# EAGLE design Logic (EAGLE 9.2.2)

## Sheet 1 of 2
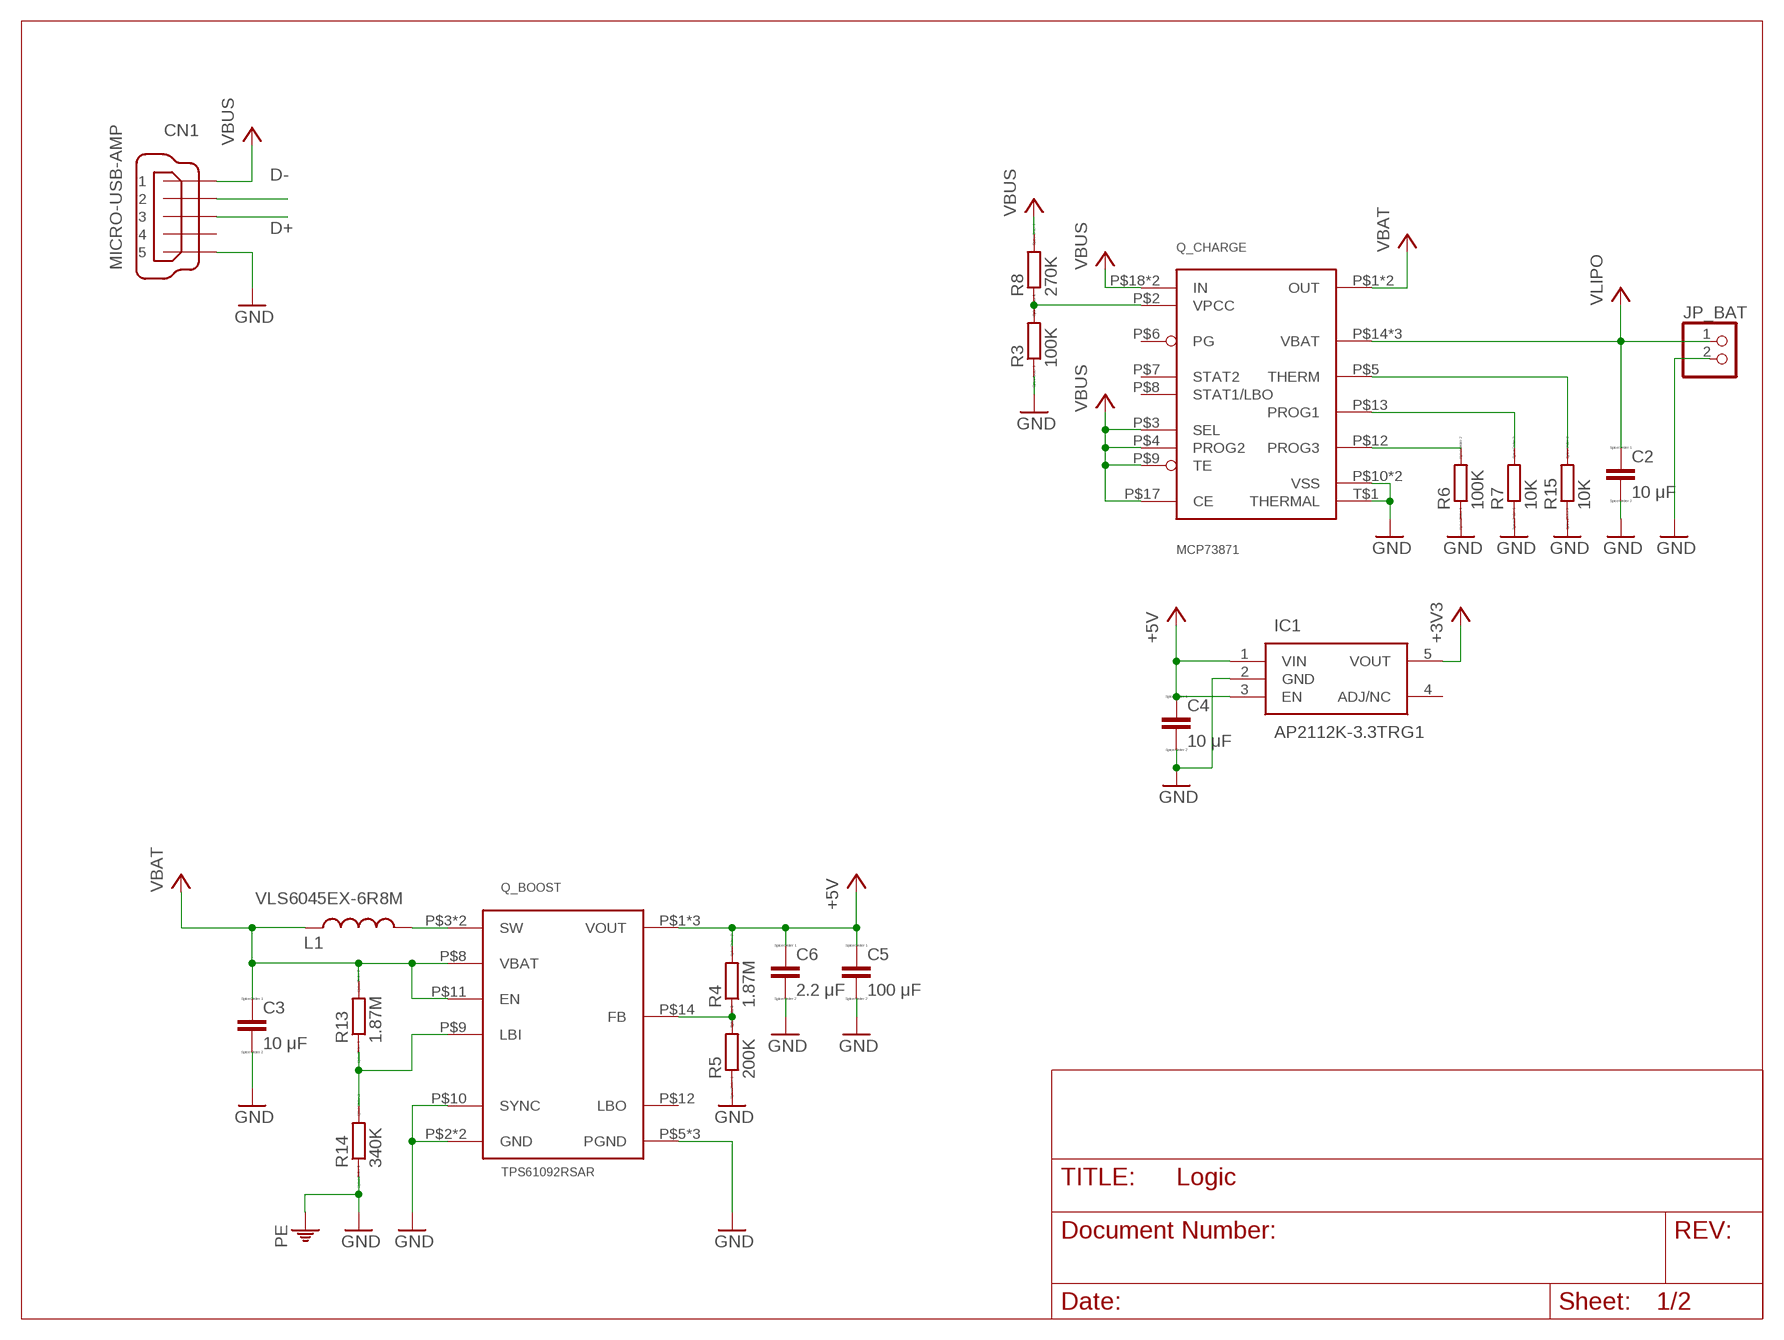
[diagram p0: schematic, sheet 1]

### Parts
C2  10 μF  CC0603  [C0603]
C3  10 μF  CC0603  [C0603]
C4  10 μF  CC0603  [C0603]
C5  100 μF  CC1206  [C1206]
C6  2.2 μF  CC0603  [C0603]
CN1  MICRO-USB-AMP  [10118193-0001LF]
IC1  AP2112K-3.3TRG1  [SOT95P282X130-5N]
JP_BAT  PINHD-1X2  [1X02]
L1  VLS6045EX-6R8M  [VLS6045EX-6R8M]
Q_BOOST  TPS61092RSAR  [TPS61092RSAR]
Q_CHARGE  MCP73871  [MCP73871]
R3  100K  RR0603  [R0603]
R4  1.87M  RR0603  [R0603]
R5  200K  RR0603  [R0603]
R6  100K  RR0603  [R0603]
R7  10K  RR0603  [R0603]
R8  270K  RR0603  [R0603]
R13  1.87M  RR0603  [R0603]
R14  340K  RR0603  [R0603]
R15  10K  RR0603  [R0603]

### Nets
+3V3: IC1.5(VOUT) ; also sheet 2
+5V: C4.1 C5.1 C6.1 IC1.1(VIN) IC1.3(EN) Q_BOOST.P$1(VOUT) Q_BOOST.P$15(VOUT) Q_BOOST.P$16(VOUT) R4.2 ; also sheet 2
D+: CN1.3 ; also sheet 2
D-: CN1.2 ; also sheet 2
FB: Q_BOOST.P$14(FB) R4.1 R5.2
GND: C2.2 C3.2 C4.2 C5.2 C6.2 CN1.5 CN1.G1 CN1.G2 IC1.2(GND) JP_BAT.2 Q_BOOST.P$2(GND) Q_BOOST.P$5(PGND) Q_BOOST.P$6(PGND) Q_BOOST.P$7(PGND) Q_BOOST.P$10(SYNC) Q_BOOST.P$13(GND) Q_CHARGE.P$10(VSS) Q_CHARGE.P$11(VSS) Q_CHARGE.T$1(THERMAL) R3.1 R5.1 R6.1 R7.1 R14.1 R15.1 ; supply symbol labelled PE ; also sheet 2
N$5: Q_BOOST.P$9(LBI) R13.1 R14.2
N$6: Q_CHARGE.P$12(PROG3) R6.2
N$7: Q_CHARGE.P$13(PROG1) R7.2
N$8: Q_CHARGE.P$5(THERM) R15.2
SW: L1.P$2 Q_BOOST.P$3(SW) Q_BOOST.P$4(SW)
VBAT: C3.1 L1.P$1 Q_BOOST.P$8(VBAT) Q_BOOST.P$11(EN) Q_CHARGE.P$1(OUT) Q_CHARGE.P$20(OUT) R13.2
VBUS: CN1.1 Q_CHARGE.P$3(SEL) Q_CHARGE.P$4(PROG2) Q_CHARGE.P$9(TE) Q_CHARGE.P$17(CE) Q_CHARGE.P$18(IN) Q_CHARGE.P$19(IN) R8.2
VLIPO: C2.1 JP_BAT.1 Q_CHARGE.P$14(VBAT) Q_CHARGE.P$15(VBAT) Q_CHARGE.P$16(VBAT) ; also sheet 2
VPCC: Q_CHARGE.P$2(VPCC) R3.2 R8.1
Unconnected: CN1.4 IC1.4(ADJ/NC) Q_BOOST.P$12(LBO) Q_CHARGE.P$6(PG) Q_CHARGE.P$7(STAT2) Q_CHARGE.P$8(STAT1/LBO)

## Sheet 2 of 2
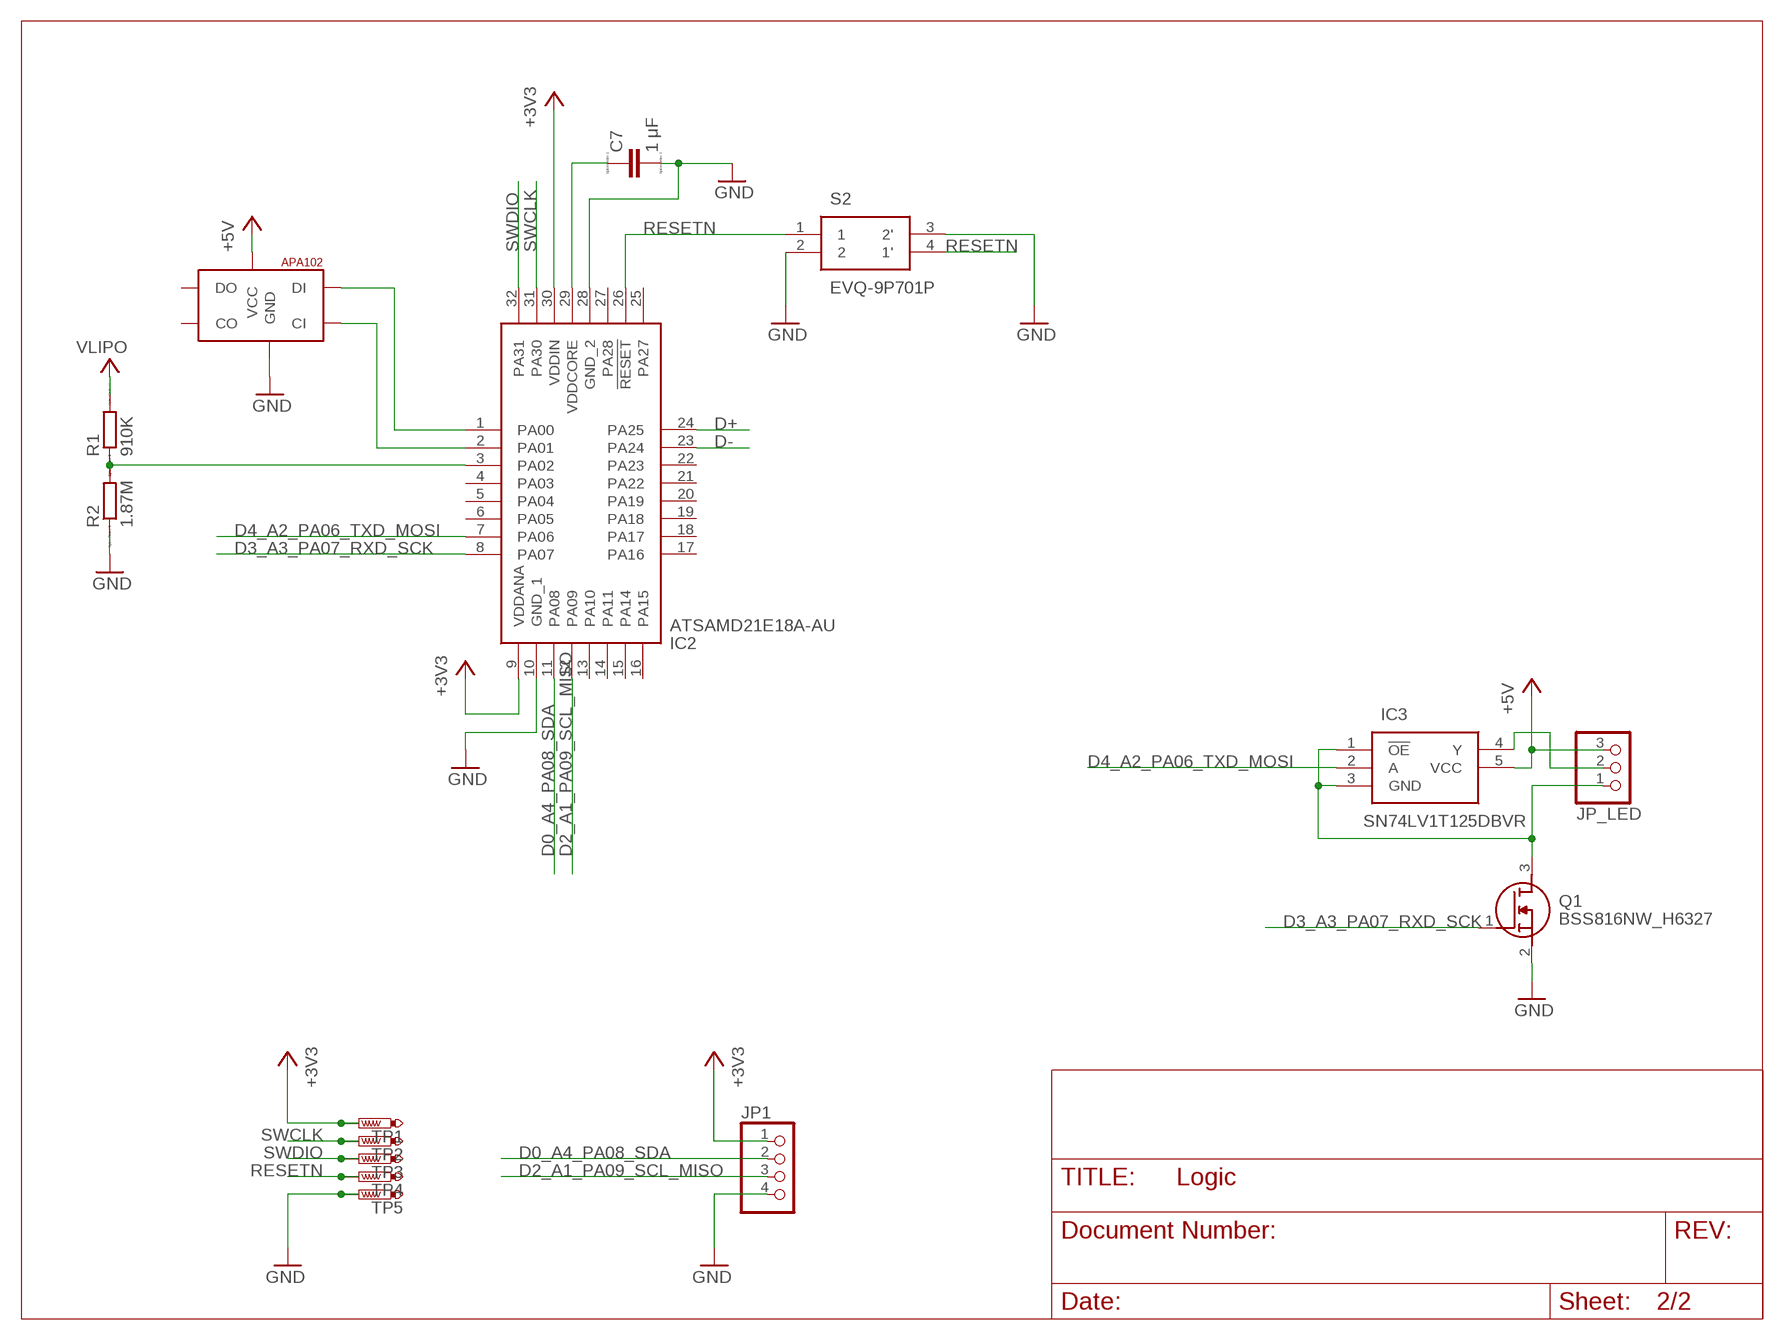
[diagram p1: schematic, sheet 2]

### Parts
C7  1 μF  CC0603  [C0603]
IC2  ATSAMD21E18A-AU  [QFP80P900X900X120-32N]
IC3  SN74LV1T125DBVR  [SOT95P280X145-5N]
JP1  PINHD-1X4  [1X04]
JP_LED  PINHD-1X3  [1X03]
Q1  BSS816NW_H6327  [SOT65P210X100-3N]
R1  910K  RR0603  [R0603]
R2  1.87M  RR0603  [R0603]
S2  EVQ-9P701P  [EVQ-9P701P]
TP1  PTR1B2,54  [B2,54]
TP2  PTR1B2,54  [B2,54]
TP3  PTR1B2,54  [B2,54]
TP4  PTR1B2,54  [B2,54]
TP5  PTR1B2,54  [B2,54]
U$2  APA1025050  [APA102_5050]

### Nets
+3V3: IC2.9(VDDANA) IC2.30(VDDIN) JP1.1 TP1.TP ; also sheet 1
+5V: IC3.5(VCC) JP_LED.3 U$2.1(VCC) ; also sheet 1
D0_A4_PA08_SDA: IC2.11(PA08) JP1.2
D2_A1_PA09_SCL_MISO: IC2.12(PA09) JP1.3
D3_A3_PA07_RXD_SCK: IC2.8(PA07) Q1.1(G)
D4_A2_PA06_TXD_MOSI: IC2.7(PA06) IC3.2(A)
D+: IC2.24(PA25) ; also sheet 1
D-: IC2.23(PA24) ; also sheet 1
GND: C7.2 IC2.10(GND_1) IC2.28(GND_2) JP1.4 Q1.2(S) R2.1 S2.2 S2.3(2') TP5.TP U$2.6(GND) ; also sheet 1
N$1: IC2.3(PA02) R1.1 R2.2
N$2: IC2.2(PA01) U$2.5(CI)
N$3: IC3.1(!OE) IC3.3(GND) JP_LED.1 Q1.3(D)
N$4: IC3.4(Y) JP_LED.2
N$9: IC2.1(PA00) U$2.4(DI)
N$35: C7.1 IC2.29(VDDCORE)
RESETN: IC2.26(!RESET) S2.1 S2.4(1') TP4.TP
SWCLK: IC2.31(PA30) TP2.TP
SWDIO: IC2.32(PA31) TP3.TP
VLIPO: R1.2 ; also sheet 1
Unconnected: IC2.4(PA03) IC2.5(PA04) IC2.6(PA05) IC2.13(PA10) IC2.14(PA11) IC2.15(PA14) IC2.16(PA15) IC2.17(PA16) IC2.18(PA17) IC2.19(PA18) IC2.20(PA19) IC2.21(PA22) IC2.22(PA23) IC2.25(PA27) IC2.27(PA28) U$2.2(CO) U$2.3(DO)

## Library data of the parts
C2-C7 = eagle-ltspice:C: CAPACITOR, European symbol; SPICEMODEL: NONE; SPICEPREFIX: C
CN1 = SDM_CustA:MICRO-USB-AMP
IC1 = SamacSys_Parts:AP2112K-3.3TRG1: 600mA 3.3V LDO Regulator Enable SOT23-5 DiodesZetex AP2112K-3.3TRG1, LDO Voltage Regulator, 3.3 V 1.5%, 2.5 6 Vin, 5-Pin SOT-23 Source: Datasheet <https://componentsearchengine.com/Datasheets/1/AP2112K-3.3TRG1.pdf>; DESCRIPTION: 600mA 3.3V LDO Regulator Enable SOT23-5 DiodesZetex AP2112K-3.3TRG1, LDO Voltage Regulator, 3.3 V 1.5%, 2.5 6 Vin, 5-Pin SOT-23; HEIGHT: 1.3mm; MANUFACTURER_NAME: Diodes Inc.; MANUFACTURER_PART_NUMBER: AP2112K-3.3TRG1; MOUSER_PART_NUMBER: 621-AP2112K-3.3TRG1
IC2 = SamacSys_Parts:ATSAMD21E18A-AU: MICROCHIP - ATSAMD21E18A-AU - MCU, 32BIT, CORTEX-M0+, 48MHZ, TQFP-32 Source: Datasheet <https://componentsearchengine.com/Datasheets/1/ATSAMD21E18A-AU.pdf>; DESCRIPTION: MICROCHIP - ATSAMD21E18A-AU - MCU, 32BIT, CORTEX-M0+, 48MHZ, TQFP-32; HEIGHT: 1.2mm; MANUFACTURER_NAME: Microchip; MANUFACTURER_PART_NUMBER: ATSAMD21E18A-AU; MOUSER_PART_NUMBER: 556-ATSAMD21E18A-AU
IC3 = SamacSys_Parts:SN74LV1T125DBVR: Single Power Supply, Single BUFFER GATE w/ 3-State Output (active low enable) Source: Datasheet <http://www.ti.com/general/docs/lit/getliterature.tsp?genericPartNumber=SN74LV1T125&&fileType=pdf>; DESCRIPTION: Single Power Supply, Single BUFFER GATE w/ 3-State Output (active low enable); HEIGHT: 1.45mm; MANUFACTURER_NAME: Texas Instruments; MANUFACTURER_PART_NUMBER: SN74LV1T125DBVR; MOUSER_PART_NUMBER: 595-SN74LV1T125DBVR
JP1 = pinhead:PINHD-1X4: PIN HEADER
JP_BAT = pinhead:PINHD-1X2: PIN HEADER
JP_LED = pinhead:PINHD-1X3: PIN HEADER
L1 = SDM_CustA:VLS6045EX-6R8M
Q1 = SamacSys_Parts:BSS816NW_H6327: Infineon BSS816NW H6327 N-channel MOSFET Transistor, 1.4 A, 20 V, 3-Pin PG-SOT-323 Source: Datasheet <https://componentsearchengine.com/Datasheets/1/BSS816NW H6327.pdf>; DESCRIPTION: Infineon BSS816NW H6327 N-channel MOSFET Transistor, 1.4 A, 20 V, 3-Pin PG-SOT-323; HEIGHT: 1mm; MANUFACTURER_NAME: Infineon; MANUFACTURER_PART_NUMBER: BSS816NW H6327; MOUSER_PART_NUMBER: 726-BSS816NWH6327
Q_BOOST = SDM_CustA:TPS61092RSAR
Q_CHARGE = SDM_CustA:MCP73871
R1-R8 R13-R15 = eagle-ltspice:R: RESISTOR, European symbol; SPICEMODEL: NONE; SPICEPREFIX: R
S2 = SamacSys_Parts:EVQ-9P701P: Tactile Switches SMD 3.5X2.9MM SID-OP L SHAPED TERM 1.6N Source: Datasheet <https://componentsearchengine.com/Datasheets/1/EVQ-9P701P.pdf>; DESCRIPTION: Tactile Switches SMD 3.5X2.9MM SID-OP L SHAPED TERM 1.6N; HEIGHT: mm; MANUFACTURER_NAME: Panasonic; MANUFACTURER_PART_NUMBER: EVQ-9P701P; MOUSER_PART_NUMBER: 667-EVQ-9P701P
TP1-TP5 = testpad:PTR1: TEST PIN
U$2 = jos-ph:APA102: APA102C 5050 RGB LED -- Adafruit DotStar Single LED Pixel Product Page: https://www.adafruit.com/products/2343 Datasheet: https://cdn-shop.adafruit.com/product-files/2343/APA102C.pdf

## Board
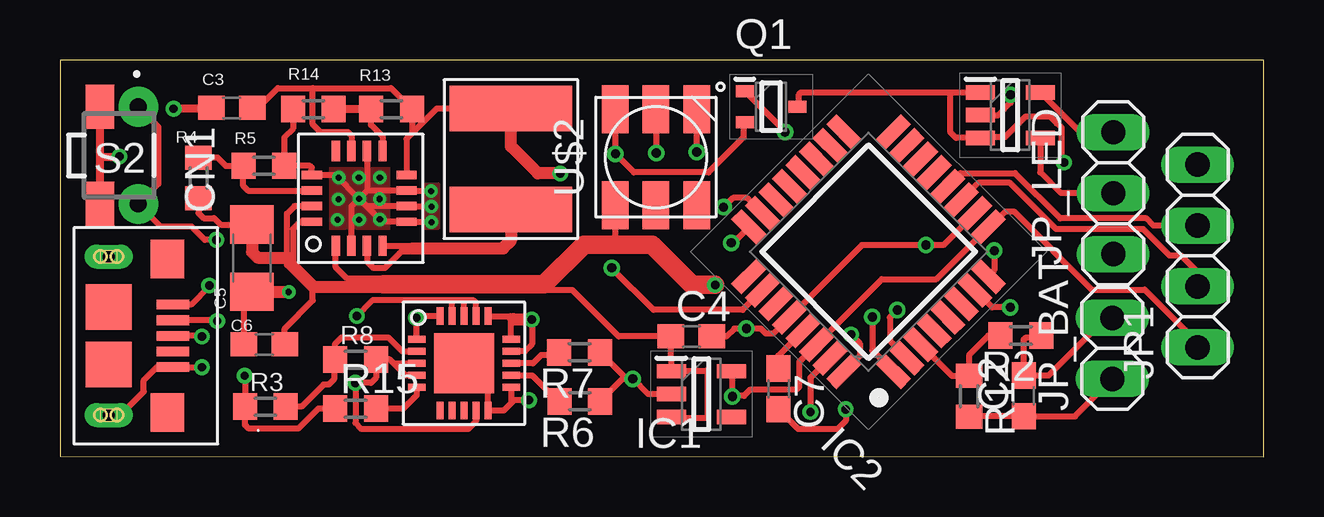
[diagram p2: board, top side]
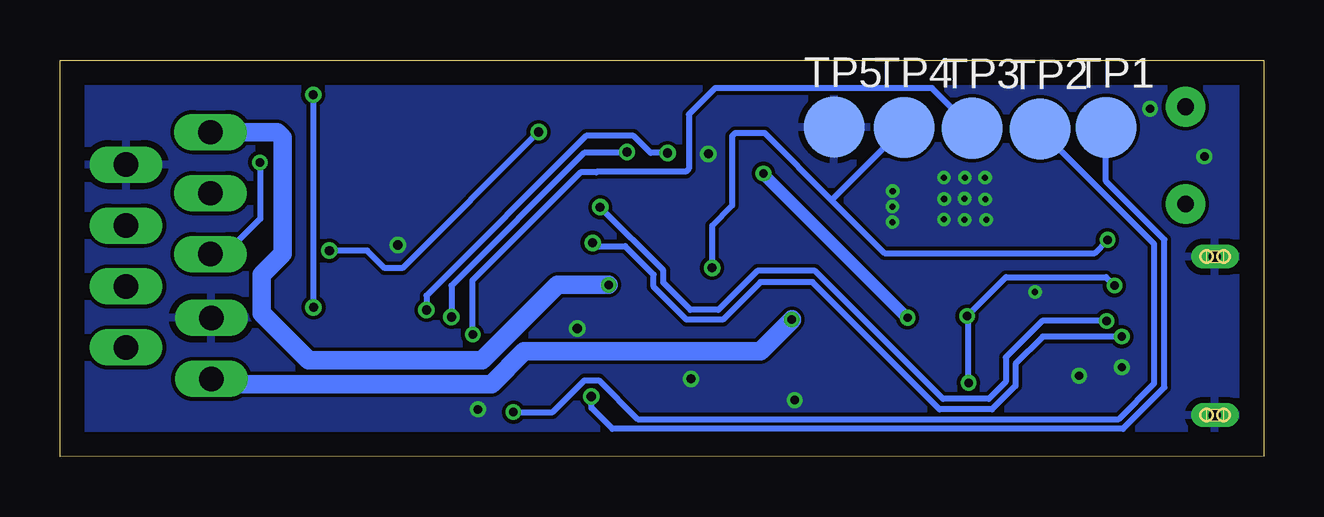
[diagram p3: board, bottom side, seen from below]

Size 50.18 x 16.52 mm. Coordinates in mm from the lower left corner, seen from the top.
Outline: 0,0.01 50.18,0 50.18,16.51 0,16.52 0,0.01
Copper layers (1*16): Top 0.035mm / dielectric 1.5mm / Bottom 0.035mm
Design rules "default *": minimum track width 6mil, minimum drill 10mil, track to track 6mil, track to pad 6mil, pad to pad 6mil, via to via 6mil, smd to smd 6mil, copper to edge 40mil, drill to drill 6mil, minimum pad ring 10mil, minimum via ring 6mil, stop-mask expansion 4mil, vias tented up to drill 0mil, thermal gap 10mil

### Footprints (pad centres in the part's own frame; a part is rotated, then mirrored left to right if it is on the bottom)
C0603 = smd 1.1 x 1: 1 -0.85,0; 2 0.85,0
C1206 = smd 1.6 x 1.8: 1 -1.4,0; 2 1.4,0
10118193-0001LF = smd 0.4 x 1.35: 1 -1.275,4.199; 2 -0.625,4.199; 3 0.025,4.199; 4 0.675,4.199; 5 1.325,4.199 | drill 0.5 pad 0.9 long: G1 3.325,1.524; G2 -3.275,1.524 | smd 1.9 x 1.9: M1 1.225,1.524; M2 -1.175,1.524 | smd 1.6 x 1.4: M3 -3.175,3.974; M4 3.225,3.974
SOT95P282X130-5N = smd 1.2 x 0.6: 1 -1.25,0.95; 2 -1.25,0; 3 -1.25,-0.95; 4 1.25,-0.95; 5 1.25,0.95
QFP80P900X900X120-32N = smd 1.5 x 0.6: 1 -4.25,2.8; 2 -4.25,2; 3 -4.25,1.2; 4 -4.25,0.4; 5 -4.25,-0.4; 6 -4.25,-1.2; 7 -4.25,-2; 8 -4.25,-2.8; 17 4.25,-2.8; 18 4.25,-2; 19 4.25,-1.2; 20 4.25,-0.4; 21 4.25,0.4; 22 4.25,1.2; 23 4.25,2; 24 4.25,2.8 | smd 0.6 x 1.5: 9 -2.8,-4.25; 10 -2,-4.25; 11 -1.2,-4.25; 12 -0.4,-4.25; 13 0.4,-4.25; 14 1.2,-4.25; 15 2,-4.25; 16 2.8,-4.25; 25 2.8,4.25; 26 2,4.25; 27 1.2,4.25; 28 0.4,4.25; 29 -0.4,4.25; 30 -1.2,4.25; 31 -2,4.25; 32 -2.8,4.25
SOT95P280X145-5N = smd 1.2 x 0.6: 1 -1.25,0.95; 2 -1.25,0; 3 -1.25,-0.95; 4 1.25,-0.95; 5 1.25,0.95
1X04 = drill 1.016 long: 1 -3.81,0; 2 -1.27,0; 3 1.27,0; 4 3.81,0
1X02 = drill 1.016 long: 1 -1.27,0; 2 1.27,0
1X03 = drill 1.016 long: 1 -2.54,0; 2 0,0; 3 2.54,0
VLS6045EX-6R8M = smd 1.9 x 5.1: P$1 -2.1,0; P$2 2.1,0
SOT65P210X100-3N = smd 0.75 x 0.5: 1 -1.1,0.65; 2 -1.1,-0.65; 3 1.1,0
TPS61092RSAR = smd 0.85 x 0.35: P$1 -1.975,0.975; P$2 -1.975,0.325; P$3 -1.975,-0.325; P$4 -1.975,-0.975; P$9 1.975,-0.975; P$10 1.975,-0.325; P$11 1.975,0.325; P$12 1.975,0.975 | smd 0.35 x 0.85: P$5 -0.975,-1.975; P$6 -0.325,-1.975; P$7 0.325,-1.975; P$8 0.975,-1.975; P$13 0.975,1.975; P$14 0.325,1.975; P$15 -0.325,1.975; P$16 -0.975,1.975
MCP73871 = smd 0.73 x 0.3: P$1 -1.965,1; P$2 -1.965,0.5; P$3 -1.965,0; P$4 -1.965,-0.5; P$5 -1.965,-1; P$11 1.965,-1; P$12 1.965,-0.5; P$13 1.965,0; P$14 1.965,0.5; P$15 1.965,1 | smd 0.3 x 0.73: P$6 -1,-1.965; P$7 -0.5,-1.965; P$8 0,-1.965; P$9 0.5,-1.965; P$10 1,-1.965; P$16 1,1.965; P$17 0.5,1.965; P$18 0,1.965; P$19 -0.5,1.965; P$20 -1,1.965 | smd 2.5 x 2.5: T$1 0,0
R0603 = smd 1 x 1.1: 1 -0.85,0; 2 0.85,0
EVQ-9P701P = drill 0.7 pad 1.651: 1 -2.025,0.8; 4 2.025,0.8 | smd 1.84 x 1.2: 2 -2.025,-0.8; 3 2.025,-0.8
B2,54 = smd 2.54 x 2.54: TP 0,0
APA102_5050 = smd 2 x 1.1: 1 2,-1.7; 2 2,0; 3 2,1.7; 4 -2,1.7; 5 -2,0; 6 -2,-1.7

### Placement (x,y rotation side)
C2  40.17,2.53 90 top
C3  7.16,14.53 180 top
C4  26.31,5 0 top
C5  8,8.27 270 top
C6  8.52,4.67 180 top
C7  29.95,2.82 270 top
CN1  0.51,5.05 270 top
IC1  26.73,2.6 0 top
IC2  33.71,8.53 135 top
IC3  39.61,14.22 0 top
JP1  47.42,8.36 90 top
JP_BAT  43.87,4.51 90 top
JP_LED  43.9,10.97 90 top
L1  18.8,12.4 270 top
Q1  29.64,14.58 0 top
Q_BOOST  12.47,10.76 90 top
Q_CHARGE  16.84,3.89 0 top
R1  37.9,2.51 270 top
R2  40.06,5.04 180 top
R3  8.56,2.08 0 top
R4  5.78,11.61 270 top
R5  8.5,12.12 180 top
R6  21.67,2.3 180 top
R7  21.65,4.34 180 top
R8  12.32,4.04 0 top
R13  13.82,14.48 0 top
R14  10.57,14.48 0 top
R15  12.32,1.99 0 top
S2  2.46,12.55 270 top
TP1  6.58,13.7 0 bottom
TP2  9.32,13.64 0 bottom
TP3  12.15,13.68 0 bottom
TP4  14.99,13.72 0 bottom
TP5  17.91,13.73 0 bottom
U$2  24.84,12.47 270 top

### Tracks (layer width: path | path; a pad name or v marks a point on that pad's centre or on a via)
+3V3  (via drill 0.38)
  Top 0.254: JP1.1 47.42,4.75 45.21,6.96 43,6.96 39.75,10.21 39.41,10.21 38.76,9.56 IC2.9 36.52,7.39 34.26,7.39 IC2.30 30.82,3.95 30.82,2.9 30.71,2.8 28.79,2.8 28.51,2.52 28.05,2.52 v28.03,2.5 28.03,3.51 IC1.5
  Bottom 0.254: v28.03,2.5 28.03,2.03 27.15,1.16 5.87,1.16 4.14,2.88 4.14,9.03 6.58,11.47 TP1.TP
+5V  (via drill 0.35)
  Top 0.254: 13.69,7.16 13.69,7.43 11.95,7.43 11.5,7.88 Q_BOOST.P$1 | 13.69,7.16 13.69,6.92 10.53,6.92 | 10.53,6.92 10.54,6.91 10.54,6.5 9.37,5.33 C6.1 | 10.53,6.92 9.46,7.99 9.46,8.31 9.46,10.12 9.77,10.43 Q_BOOST.P$15 | 13.53,7.16 13.51,7.18 10.63,7.18 9.72,8.09 9.72,9.49 10.01,9.78 Q_BOOST.P$16 | 13.53,7.16 13.69,7.16 | IC1.3 25.52,1.61 27.03,1.61 27,1.64 27,3.59 26.99,3.61 26.93,3.55 IC1.1 25.48,4.11 25.46,4.13 C4.1 23.29,5 21.36,6.93 19.27,6.93 19.01,7.19 | JP_LED.3 42.52,13.51 IC3.5 | R4.2 5.78,10.15 5.99,9.93 6.43,9.93 6.69,9.67 C5.1 | 13.53,7.16 13.52,7.16 13.49,7.19 | U$2.1 23.14,8.98 23.29,8.83 24.68,8.83
  Top 0.508: C5.1 8,8.52 8.23,8.29 9.45,8.29 9.46,8.31
  Top 0.762: 13.49,7.19 19.01,7.19 20.18,7.19 21.85,8.82 22.11,8.82 22.11,8.83 24.68,8.83 26.35,7.15 v27.3,7.15
  Bottom 0.762: v27.3,7.15 29.44,7.15 32.58,4.01 39.81,4.01 41.77,5.97 41.77,7.57 40.89,8.45 40.89,13.28 41.12,13.51 JP_LED.3
D0_A4_PA08_SDA
  Top 0.254: IC2.11 38.27,11.4 39.6,11.4 41.53,9.47 45.15,9.47 46.24,8.38 46.72,8.38 47.42,7.68 JP1.2
D2_A1_PA09_SCL_MISO
  Top 0.254: IC2.12 37.55,11.81 39.8,11.81 41.7,9.92 45.29,9.92 45.58,9.63 JP1.3
D3_A3_PA07_RXD_SCK  (via drill 0.38)
  Top 0.254: v38.95,8.58 38.95,7.76 IC2.8 | Q1.1 30.23,13.55 v30.23,13.53
  Bottom 0.254: v38.95,8.58 37.37,8.58 36.64,7.85 35.9,7.85 v30.23,13.53
D4_A2_PA06_TXD_MOSI  (via drill 0.38)
  Top 0.254: IC2.7 38.86,6.21 39.6,6.21 v39.61,6.22 | IC3.2 39.11,14.22 39.62,14.74 v39.62,15.07
  Bottom 0.254: v39.62,15.07 39.62,6.23 v39.61,6.22
D+  (via drill 0.35, 0.38)
  Top 0.254: CN1.3 5.92,5.03 v5.92,5 | IC2.24 28.06,8.9 v27.98,8.9
  Bottom 0.254: v5.92,5 6.28,5 6.28,4.99 6.83,4.99 6.83,5 9.21,5 10.35,3.86 10.35,2.94 11.32,1.97 13.52,1.97 18.81,7.26 20.98,7.26 22.54,5.7 24.07,5.7 25.44,7.07 25.44,7.58 26.62,8.76 27.84,8.76 v27.98,8.9
D-  (via drill 0.35, 0.38)
  Top 0.254: CN1.2 6.53,5.68 v6.55,5.65 | IC2.23 28.63,10.78 28.05,10.78 v27.66,10.39
  Bottom 0.254: v6.55,5.65 9.23,5.65 10.76,4.13 10.76,3.11 11.47,2.4 13.37,2.4 18.71,7.73 21.11,7.73 22.73,6.11 23.9,6.11 25.03,7.24 25.03,7.76 v27.66,10.39
FB
  Top 0.254: R4.1 6.57,12.46 6.92,12.1 7.63,12.1 7.64,12.09 7.64,11.28 7.84,11.08 Q_BOOST.P$14
  Top 0.343: R5.2 7.63,12.1
GND  (via drill 0.25 pad 0.51, 0.35, 0.38)
  Top 0.254: R14.1 9.72,13.67 9.35,13.3 R5.1 10.42,12.12 10.5,12.04 Q_BOOST.P$13 11.48,11.73 v12.47,10.74 | v15.47,11.06 15.45,11.08 Q_BOOST.P$7 12.81,11.08 v12.47,10.74 | v15.48,9.77 15.47,9.78 Q_BOOST.P$5 13.43,9.78 v12.47,10.74 | v15.48,10.41 15.46,10.43 Q_BOOST.P$6 12.78,10.43 v12.47,10.74 | v7.7,3.37 v7.71,3.35 R3.1 7.71,1.32 7.87,1.16 9.94,1.16 10.77,1.99 R15.1 | C6.2 7.67,6.54 C5.2 | v5.92,3.72 v5.91,3.73 CN1.5 4.03,3.73 3.49,3.19 3.49,2.7 2.52,1.73 CN1.G1 | IC1.2 24.51,2.6 v23.88,3.24 | U$2.6 v23.14,12.62 v23.15,12.61 23.93,11.84 27.04,11.84 28.5,13.3 28.5,13.89 Q1.2 | R2.1 40.8,4.94 40.23,4.94 40.17,4.88 C2.2 41.21,3.38 43.61,5.78 JP_BAT.2 | C4.2 27.77,5 28.11,5.33 v28.61,5.33 29.21,5.33 29.43,5.12 29.72,5.12 IC2.28 33.42,8.81 v36.09,8.81 36.81,8.81 IC2.10 | Q_CHARGE.P$11 18.8,2.22 | 18.8,2.22 18.5,1.92 Q_CHARGE.P$10 17.84,2.89 Q_CHARGE.T$1 | C7.2 30.77,1.15 32.42,1.15 32.75,1.48 v32.75,1.97 | R7.1 23.61,3.24 v23.88,3.24 | R6.1 23.46,3.24 v23.88,3.24 | v19.55,2.35 18.93,2.35 18.8,2.22 | Q_BOOST.P$2 12.15,10.42 v12.47,10.74 | Q_BOOST.P$10 12.8,11.07 v12.47,10.74
  Top 0.343: C3.2 6.28,14.49 v4.74,14.49 | S2.2 1.66,12.5 | 1.66,12.5 S2.3 | 1.66,12.5 v2.48,12.5
  Top 0.508: C5.2 9.53,6.87 v9.54,6.86
  other vias: 11.57,9.87 12.47,9.87 13.34,9.88 13.32,10.73 11.61,10.72 11.62,11.62 12.46,11.62 13.34,11.62
  pour Bottom: 0.03,16.54 0,0.01 50.25,0.01 50.25,16.49 0.05,16.5
  pour Top: 15.2,11.37 15.77,11.37 15.77,9.5 15.2,9.5
  pour Top: 11.23,12.03 11.23,9.47 13.77,9.47 13.77,12.03
N$1
  Top 0.254: R2.2 38.7,5.04 37.9,4.24 R1.1 37.18,3.36 IC2.3
N$2  (via drill 0.38)
  Top 0.254: U$2.5 v24.84,12.66 v24.85,12.65 | IC2.2 34.59,4.83 34.59,5.79 v34.9,6.11
  Bottom 0.254: v34.9,6.11 34.9,6.71 28.25,13.36 26.26,13.36 25.55,12.65 v24.85,12.65
N$3  (via drill 0.35)
  Top 0.254: Q1.3 30.81,14.65 30.81,15.1 30.88,15.17 37.11,15.17 | 37.11,15.17 IC3.1 | 37.11,15.17 37.11,13.51 37.35,13.27 IC3.3 38.4,13.31 39.4,13.31 40.26,14.17 41.25,14.17 41.54,13.88 41.58,13.88 41.74,13.71 41.74,12.36 v41.85,12.26
  Bottom 0.254: v41.85,12.26 41.83,12.24 41.83,9.91 43.31,8.43 JP_LED.1
N$4
  Top 0.254: IC3.4 40.86,11.84 41.73,10.98 JP_LED.2
N$5
  Top 0.254: R13.1 12.97,13.82 13.45,13.34 Q_BOOST.P$9
  Top 0.343: R13.1 R14.2
N$6
  Top 0.254: Q_CHARGE.P$12 19.68,3.39 20.77,2.3 R6.2
N$7
  Top 0.254: R7.2 20.69,4.23 20.05,4.23 19.71,3.89 Q_CHARGE.P$13
N$8
  Top 0.254: Q_CHARGE.P$5 14.88,2.57 14.3,2 R15.2
N$9  (via drill 0.38)
  Top 0.254: U$2.4 v26.54,12.69 | v33.86,5.82 33.86,4.42 IC2.1
  Bottom 0.254: v26.54,12.69 26.58,12.65 28.33,12.65 33.86,7.12 v33.86,5.82
N$35
  Top 0.254: IC2.29 29.95,4.21 C7.1
RESETN  (via drill 0.35, 0.38)
  Top 0.254: v23,7.86 23,7.85 24.74,6.11 28.45,6.11 IC2.26 | v6.51,9.03 6.03,9.03 5.49,9.58 4.21,9.58 S2.4 4.1,11.36 4.1,13.73 S2.1
  Bottom 0.254: v23,7.86 23,9.63 22.16,10.46 22.16,13.35 22.04,13.47 20.8,13.47 18.01,10.69 | TP4.TP 18.01,10.69 | 18.01,10.69 18.02,10.68 15.81,8.47 7.05,8.47 6.51,9 v6.51,9.03
SW
  Top 0.254: Q_BOOST.P$3 12.8,8.12 13.06,7.86 13.55,7.86 14.24,8.55 14.55,8.55 14.68,8.67 14.57,8.78 Q_BOOST.P$4
  Top 0.508: L1.P$2 18.8,8.99 18.48,8.67 14.68,8.67
SWCLK  (via drill 0.35)
  Top 0.254: IC2.31 31.28,3.28 v31.28,1.85
  Bottom 0.254: v31.28,1.85 29.64,1.85 28.32,3.17 27.71,3.17 26.1,1.56 6.05,1.56 4.57,3.04 4.57,8.85 9.32,13.6 TP2.TP
SWDIO  (via drill 0.35)
  Top 0.254: v32.97,5.08 33.34,4.71 33.34,4.21 IC2.32
  Bottom 0.254: TP3.TP 13.83,15.35 22.87,15.35 23.96,14.26 23.96,12 24.09,11.87 27.79,11.87 27.83,11.84 28.49,11.84 32.99,7.33 32.99,5.12 32.97,5.12 v32.97,5.08
VBAT  (via drill 0.35)
  Top 0.254: 14.68,13.47 14.68,14.47 R13.2 13.79,15.35 10.54,15.35 | 14.68,13.47 14.45,13.24 Q_BOOST.P$8 | 8.26,14.53 9.08,15.35 10.54,15.35 | 10.54,15.35 10.54,13.85 10.87,13.51 12,13.51 12.15,13.37 Q_BOOST.P$11 | L1.P$1 15.7,14.49 14.68,13.47 | Q_CHARGE.P$1 14.85,4.89 v14.85,5.78 14.92,5.85 Q_CHARGE.P$20
  Top 0.343: C3.1 8.26,14.53
  Top 0.508: v20.85,11.8 19.92,11.8 18.8,12.92 L1.P$1
  Bottom 0.508: v20.85,11.8 20.85,11.77 14.87,5.78 v14.85,5.78
VBUS  (via drill 0.35)
  Top 0.254: 13.91,3.89 Q_CHARGE.P$3 | Q_CHARGE.P$4 14.41,3.39 13.91,3.89 | 13.91,3.89 13.74,4.05 13.18,4.05 R8.2 13.17,3.28 12.97,3.07 v12.31,3.07 12.31,1.4 12.56,1.16 17.03,1.16 17.34,1.46 Q_CHARGE.P$9 | CN1.1 5.47,6.33 6.22,7.09 v6.22,7.12 | 16.88,6.5 17.25,6.5 17.34,6.41 Q_CHARGE.P$17 | 16.88,6.5 16.32,6.5 | 16.32,6.5 13.02,6.5 v12.37,5.85 | Q_CHARGE.P$18 16.84,6.46 16.88,6.5 | Q_CHARGE.P$19 16.34,6.48 16.32,6.5
  Bottom 0.254: v12.31,3.07 12.31,5.78 12.37,5.84 v12.37,5.85 10.74,7.48 6.58,7.48 v6.22,7.12
VLIPO  (via drill 0.35)
  Top 0.254: JP_BAT.1 42.3,1.68 C2.1 37.91,1.68 R1.2 | Q_CHARGE.P$16 18.77,5.85 18.8,5.81 | Q_CHARGE.P$15 18.8,5.81 | 18.89,5.72 18.8,5.81 | Q_CHARGE.P$14 19.37,4.39 19.67,4.69 v19.67,5.71
  Top 0.508: 18.89,5.72 19.49,5.72 v19.67,5.71
  Bottom 0.762: v19.67,5.71 19.67,5.69 20.98,4.38 30.83,4.38 32.2,3.01 43.87,3.01 JP_BAT.1
VPCC
  Top 0.254: Q_CHARGE.P$2 14.27,4.39 13.69,4.97 11.73,4.97 11.47,4.7 R8.1 11.42,3.99 11.42,3.21 11.2,3 10.99,3 10.07,2.08 R3.2